# Altium schematic sheet Power_Input_FET.SchDoc: Power Input
size OrCAD A; DocumentNumber: LM-008; Revision: D
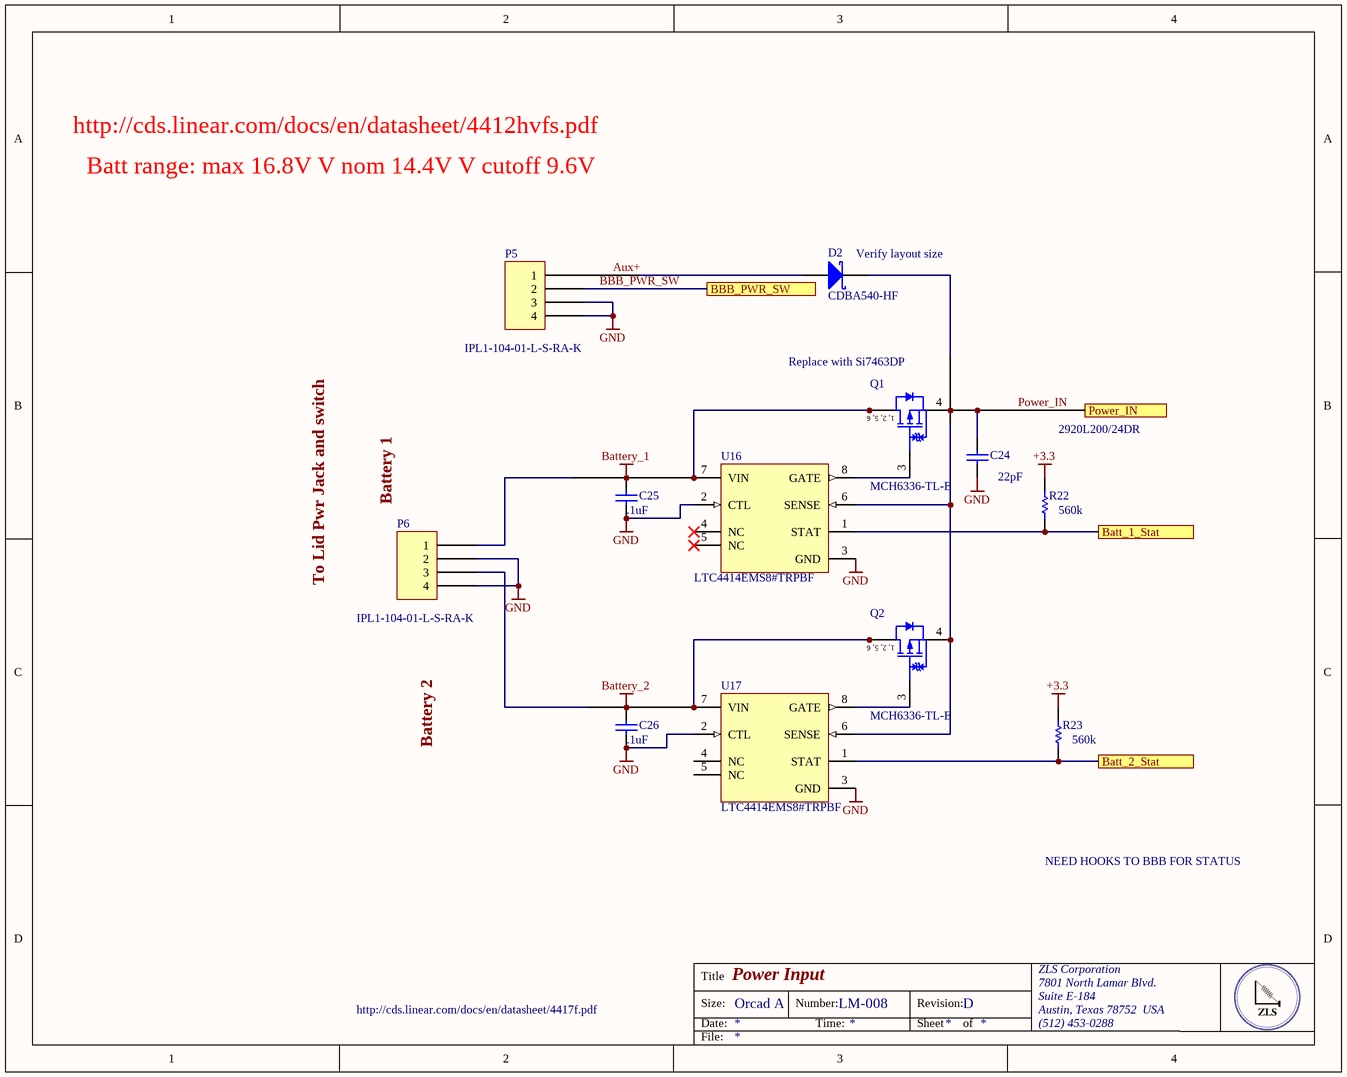
[diagram p0: Power_Input_FET.SchDoc]

## Parts
C24  Capacitance: 22pF  [CAPC1206(3216)130_N]  (hidden comment: CAP CER 10UF 6.3V X5R 1206)
C25  Capacitance: .1uF  [CAPC1206(3216)130_N]  (hidden comment: CAP CER 10UF 6.3V X5R 1206)
C26  Capacitance: .1uF  [CAPC1206(3216)130_N]  (hidden comment: CAP CER 10UF 6.3V X5R 1206)
D2  CDBA540-HF  [VISH-DO-214AC-2_M]
P5  IPL1-104-01-L-S-RA-K  [IPL1-104-01-L-S-RA-K]
P6  IPL1-104-01-L-S-RA-K  [IPL1-104-01-L-S-RA-K]
Q1  MCH6336-TL-E  [ONSC-MCPH-6_V]
Q2  MCH6336-TL-E  [ONSC-MCPH-6_V]
R22  560k  [RESC0402(1005)_L]
R23  560k  [RESC0402(1005)_L]
U16  LTC4414EMS8#TRPBF  [LT-MS8-8_L]
U17  LTC4414EMS8#TRPBF  [LT-MS8-8_L]

## Ports
Batt_1_Stat, Batt_2_Stat, BBB_PWR_SW, Power_IN

## Nets
+3.3: R22.2 R23.2
Battery_1: C25.2 P6.1 Q1.1(D) Q1.2(D) Q1.5(D) Q1.6(D) U16.7(VIN)
Battery_2: C26.2 P6.3 Q2.1(D) Q2.2(D) Q2.5(D) Q2.6(D) U17.7(VIN)
GND: C24.1 C25.1 C26.1 P5.3 P5.4 P6.2 P6.4 U16.2(CTL) U16.3(GND) U17.2(CTL) U17.3(GND)
Aux+: D2.1(A) P5.1
Batt_1_Stat: R22.1 U16.1(STAT) ; port Batt_1_Stat
Batt_2_Stat: R23.1 U17.1(STAT) ; port Batt_2_Stat
BBB_PWR_SW: P5.2 ; port BBB_PWR_SW
Power_IN: C24.2 D2.2(K) Q1.4(S) Q2.4(S) U16.6(SENSE) U17.6(SENSE) ; port Power_IN
NetQ1_3: Q1.3(G) U16.8(GATE)
NetQ2_3: Q2.3(G) U17.8(GATE)

Not connected (* = marked no-connect by the designer): U16 4(NC)* 5(NC)*; U17 4(NC) 5(NC)

## Notes on the sheet
- http://cds.linear.com/docs/en/datasheet/4412hvfs.pdf
- Batt range: max 16.8V V nom 14.4V V cutoff 9.6V
- (near D2) Verify layout size
- (near Q1) Replace with Si7463DP
- 2920L200/24DR
- Battery 1
- To Lid Pwr Jack and switch
- Battery 2
- NEED HOOKS TO BBB FOR STATUS
- http://cds.linear.com/docs/en/datasheet/4417f.pdf
- Title
- Size:
- Date:
- Orcad A
- Number:
- Time:
- Revision:
- Sheet
- of
- ZLS Corporation
- 7801 North Lamar Blvd.
- Suite E-184
- Austin, Texas 78752  USA
- (512) 453-0288
- File:
- (in symbol CMP-1058-00598-1) 1, 2, 5, 6

## Library data of the parts
C24-C26 = CMP-1037-04913-1: Manufacturer: Taiyo Yuden; Manufacturer Part Number: JMK316BJ106ML-T; Tolerance: ±20%; Notification: Current market demand for these product types have resulted in fluctuating and extending lead times. Lead times may differ.; Supplier 1: Digi-Key; Supplier Part Number 1: 587-5447-1-ND; RoHS: RoHS Compliant; Category: Capacitors; Stock 1: 5600; Pricing 1: 1=0.24, 10=0.161, 100=0.0817, 500=0.05592, 1000=0.04946 (USD); Packaging: Cut Tape (CT); Part Status: Active; Voltage - Rated: 6.3V; Temperature Coefficient: X5R; Operating Temperature: -55°C ~ 85°C; Features: -; Ratings: -; Applications: SMPS Filtering; Failure Rate: -; Mounting Type: Surface Mount, MLCC; Package / Case: 1206 (3216 Metric); Size / Dimension: 0.126" L x 0.063" W (3.20mm x 1.60mm); Height - Seated (Max): -; Thickness (Max): 0.071" (1.80mm); Lead Spacing: -; Lead Style: -; ComponentLink1URL: http://ds.yuden.co.jp/TYCOMPAS/ut/detail.do?productNo=JMK316BJ106ML-T&fileName=JMK316BJ106ML-T_SS&mode=specSheetDownload; ComponentLink1Description: http://ds.yuden.co.jp/TYCOMPAS/ut/detail.do?productNo=JMK316BJ106ML-T&fileName=JMK316BJ106ML-T_SS&mode=specSheetDownload
D2 = D Schottky: DIODE SCHOTTKY 40V 5A DO214AB; Manufacturer: Comchip Technology; Speed: Fast Recovery =< 500ns, > 200mA (Io); Capacitance @ Vr, F: 380pF @ 4V, 1MHz; Supplier 1: Digi-Key; Supplier Part Number 1: 641-1707-6-ND; Manufacturer Part Number: CDBA540-HF; RoHS: RoHS Compliant; Category: Discrete Semiconductor Products; Stock 1: 7367; Pricing 1: 1=0.49, 10=0.381, 25=0.3208, 100=0.2612, 250=0.2164, 500=0.1791, 1000=0.13432, 2500=0.12313 (USD); Packaging: Digi-Reel®; Part Status: Active; Diode Type: Schottky; Current - Average Rectified (Io): 5A; Mounting Type: Surface Mount; Package / Case: DO-214AC, SMA; Supplier Device Package: DO-214AC (SMA); Operating Temperature - Junction: -50°C ~ 150°C; ComponentLink1URL: http://www.comchiptech.com/cms/UserFiles/CDBA540-HF%20Thru505315.%20CDBA5200-HF%20RevC.pdf; ComponentLink1Description: http://www.comchiptech.com/cms/UserFiles/CDBA540-HF%20Thru505315.%20CDBA5200-HF%20RevC.pdf
P5 P6 = IPL1-104-01-L-S-RA-K: Manufacturer: Samtec Inc.; Connector Type: Header; Pitch - Mating: 0.100" (2.54mm); Number of Positions: 4; Number of Positions Loaded: All; Style: Board to Cable/Wire; Shrouding: Shrouded - 4 Wall; Contact Length - Mating: 0.215" (5.46mm); Contact Length - Post: 0.085" (2.16mm); Material Flammability Rating: UL94 V-0; Voltage Rating: 675VAC, 954VDC; Supplier 1: Digi-Key; Supplier Part Number 1: SAM9597-ND; Manufacturer Part Number: IPL1-104-01-L-S-RA-K; RoHS: RoHS Compliant; Category: Connectors, Interconnects; Stock 1: 265; Pricing 1: 1=2.53, 10=2.424, 100=2.02, 500=1.717, 1000=1.4645, 5000=1.313 (USD); Packaging: Tube; Part Status: Active; Contact Type: Male Pin; Number of Rows: 1; Row Spacing - Mating: -; Mounting Type: Through Hole, Right Angle; Termination: Solder; Fastening Type: Locking Ramp; Overall Contact Length: -; Insulation Height: 0.240" (6.10mm); Contact Shape: Square; Contact Finish - Mating: Gold; Contact Finish Thickness - Mating: 10µin (0.25µm); Contact Finish - Post: Tin; Contact Material: Phosphor Bronze; Insulation Material: Liquid Crystal Polymer (LCP); Features: -; Operating Temperature: -55°C ~ 125°C; Ingress Protection: -; Insulation Color: Natural; Current Rating: -; Mated Stacking Heights: -; Contact Finish Thickness - Post: -; Applications: -; ComponentLink1URL: http://suddendocs.samtec.com/prints/ipl1-1xx-xx-xxx-s-xx-x-xx-mkt.pdf; ComponentLink1Description: http://suddendocs.samtec.com/prints/ipl1-1xx-xx-xxx-s-xx-x-xx-mkt.pdf
Q1 Q2 = CMP-1058-00598-1: P-Channel Power MOSFET, -12 V, -5 A, 43 mOhm, Single, 6-Pin MCPH, Pb-Free, Tape and Reel; Manufacturer: On Semiconductor; Channel Polarity: P Channel; VGS(th) Max (V): 1.4; Ciss Typ (pF): 660; V(BR)DSS Min (V): 12; VGS Max (V): 10; Crss Typ (pF): 155; Coss Typ (pF): 210; PD Max (W): 1.5; ID Max (A): 5; Package Type: SC-88FL / MCPH-6; ComponentLink2URL: http://www.onsemi.cn/pub_link/Collateral/MCH6336-D.PDF; ComponentLink3URL: http://www.onsemi.com/pub_link/Collateral/ENA1601-D.PDF; RoHS: Pb-Free; Mounting Technology: Surface Mount; PartNumber: MCH6336-TL-E; ComponentLink2Description: Datasheet; ComponentLink1URL: http://www.onsemi.com/; ComponentLink1Description: Manufacturer URL; Configuration: Single; ComponentLink3Description: Package Specification; Packing: Tape and Reel; PackageDescription: 6-Pin Small Outline Transistor, Body 2 x 1.6 mm, Pitch 0.65 mm; PackageReference: MCPH-6
R22 R23 = CMP-1011-00927-1: Tolerance: ±1%; Temperature Coefficient: ±100ppm/°C; Supplier Part Number 1: YAG3220CT-ND; Supplier Device Package: 0402
U16 U17 = CMP-0479-00214-1: Low Loss PowerPath Controller for Large PFET, 3 to 36 V Vin, 8-pin SOP (MS8-8), -40 to 85 degC, Pb-Free, Tape and Reel; Manufacturer: Linear Technology; Ideal Diode: Single, External, P-Channel; ComponentLink3URL: http://cds.linear.com/docs/en/packaging/05081660_G_MS8.pdf; DatasheetVersion: Rev. C; ComponentLink2Description: Datasheet; ComponentLink1Description: Manufacturer URL; ComponentLink2URL: http://cds.linear.com/docs/en/datasheet/4414fc.pdf; ComponentLink3Description: Package Specification; ComponentLink1URL: http://www.linear.com/; Packing: Tape and Reel; Mounting Technology: Surface Mount; PackageDescription: 8-Pin Plastic MSOP, Body 3 x 3 mm, Pitch 0.65 mm; PackageVersion: Rev. G, 03/2012; PackageReference: MS8-8; PartNumber: LTC4414EMS8#TRPBF; RoHS: TRUE